# EAGLE schematic snesbotv2 (EAGLE 7.5.0)
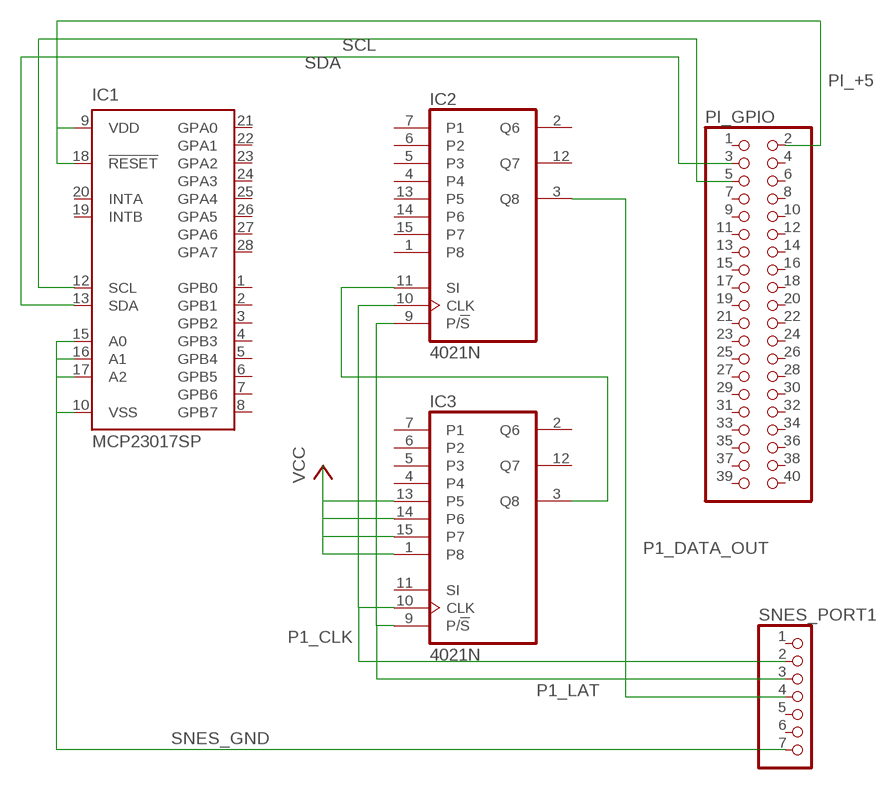
[diagram p0: schematic, sheet 1]

## Parts
IC1  MCP23017SP  [DIL28-3]
IC2  4021N  [DIL16]
IC3  4021N  [DIL16]
PI_GPIO  PINHD-2X20  [2X20]
SNES_PORT1  PINHD-1X7  [1X07]

## Nets
N$7: IC3.1(P8) IC3.13(P5) IC3.14(P6) IC3.15(P7)
N$8: IC2.11(SI) IC3.3(Q8)
P1_CLK: IC2.10(CLK) IC3.10(CLK) SNES_PORT1.2
P1_DATA_OUT: IC2.3(Q8) SNES_PORT1.4
P1_LAT: IC2.9(P/!S) IC3.9(P/!S) SNES_PORT1.3
PI_+5: IC1.9(VDD) IC1.18(!RESET) PI_GPIO.2
SCL: IC1.12(SCL) PI_GPIO.5
SDA: IC1.13(SDA) PI_GPIO.3
SNES_GND: IC1.10(VSS) IC1.15(A0) IC1.16(A1) IC1.17(A2) SNES_PORT1.7
Unconnected: IC1.1(GPB0) IC1.2(GPB1) IC1.3(GPB2) IC1.4(GPB3) IC1.5(GPB4) IC1.6(GPB5) IC1.7(GPB6) IC1.8(GPB7) IC1.19(INTB) IC1.20(INTA) IC1.21(GPA0) IC1.22(GPA1) IC1.23(GPA2) IC1.24(GPA3) IC1.25(GPA4) IC1.26(GPA5) IC1.27(GPA6) IC1.28(GPA7) IC2.1(P8) IC2.2(Q6) IC2.4 IC2.5(P3) IC2.6(P2) IC2.7(P1) IC2.12(Q7) IC2.13(P5) IC2.14(P6) IC2.15(P7) IC3.2(Q6) IC3.4 IC3.5(P3) IC3.6(P2) IC3.7(P1) IC3.11(SI) IC3.12(Q7) PI_GPIO.1 PI_GPIO.4 PI_GPIO.6 PI_GPIO.7 PI_GPIO.8 PI_GPIO.9 PI_GPIO.10 PI_GPIO.11 PI_GPIO.12 PI_GPIO.13 PI_GPIO.14 PI_GPIO.15 PI_GPIO.16 PI_GPIO.17 PI_GPIO.18 PI_GPIO.19 PI_GPIO.20 PI_GPIO.21 PI_GPIO.22 PI_GPIO.23 PI_GPIO.24 PI_GPIO.25 PI_GPIO.26 PI_GPIO.27 PI_GPIO.28 PI_GPIO.29 PI_GPIO.30 PI_GPIO.31 PI_GPIO.32 PI_GPIO.33 PI_GPIO.34 PI_GPIO.35 PI_GPIO.36 PI_GPIO.37 PI_GPIO.38 PI_GPIO.39 PI_GPIO.40 SNES_PORT1.1 SNES_PORT1.5 SNES_PORT1.6

## Power pins joined to a net without a drawn wire
VDD: IC2.16(VDD) IC3.16(VDD)
VSS: IC2.8(VSS) IC3.8(VSS)

## Library data of the parts
IC1 = adafruit:MCP23017: http://ww1.microchip.com/downloads/en/DeviceDoc/21952a.pdf Source: http://ww1.microchip.com/downloads/en/DeviceDoc/21952a.pdf
IC2 IC3 = 40xx:4021: 8-bit static SHIFT REGISTER
PI_GPIO = pinhead:PINHD-2X20: PIN HEADER
SNES_PORT1 = pinhead:PINHD-1X7: PIN HEADER